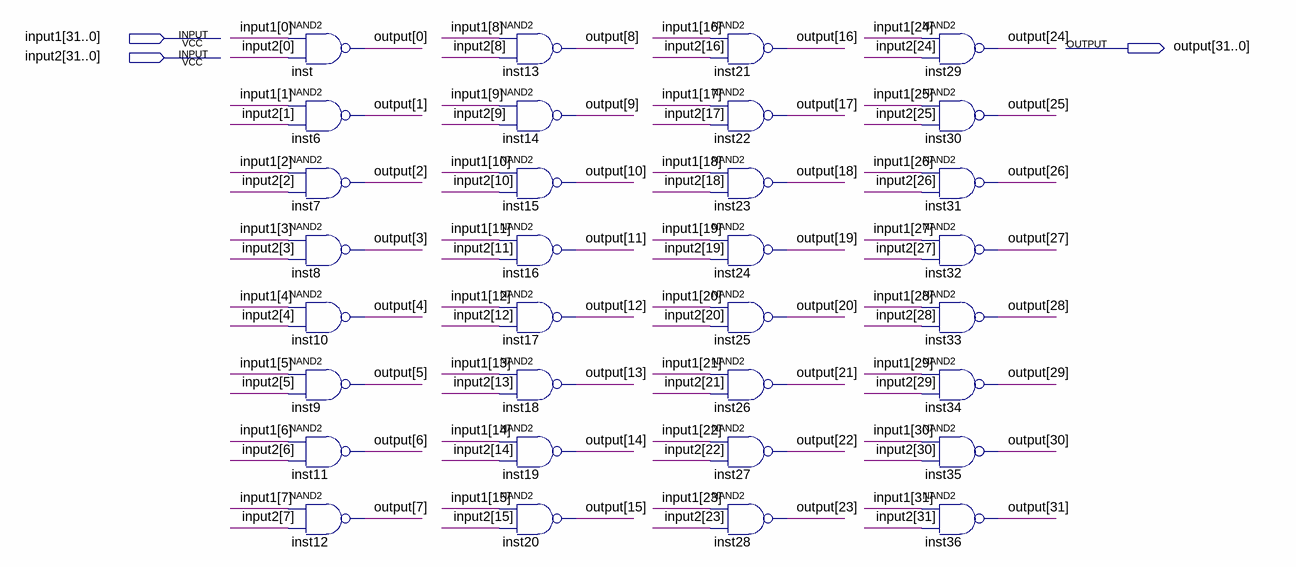
[diagram p0: schematic sheet]
// Quartus schematic Nand32.bdf as structural Verilog: 32 symbols, 3 pins
module Nand32 (
  input  [31:0] input1,
  input  [31:0] input2,
  output [31:0] \output 
);

  nand inst (\output [0], input1[0], input2[0]);
  nand inst6 (\output [1], input1[1], input2[1]);
  nand inst7 (\output [2], input1[2], input2[2]);
  nand inst8 (\output [3], input1[3], input2[3]);
  nand inst10 (\output [4], input1[4], input2[4]);
  nand inst9 (\output [5], input1[5], input2[5]);
  nand inst11 (\output [6], input1[6], input2[6]);
  nand inst12 (\output [7], input1[7], input2[7]);
  nand inst13 (\output [8], input1[8], input2[8]);
  nand inst14 (\output [9], input1[9], input2[9]);
  nand inst15 (\output [10], input1[10], input2[10]);
  nand inst16 (\output [11], input1[11], input2[11]);
  nand inst17 (\output [12], input1[12], input2[12]);
  nand inst18 (\output [13], input1[13], input2[13]);
  nand inst19 (\output [14], input1[14], input2[14]);
  nand inst20 (\output [15], input1[15], input2[15]);
  nand inst21 (\output [16], input1[16], input2[16]);
  nand inst22 (\output [17], input1[17], input2[17]);
  nand inst23 (\output [18], input1[18], input2[18]);
  nand inst24 (\output [19], input1[19], input2[19]);
  nand inst25 (\output [20], input1[20], input2[20]);
  nand inst26 (\output [21], input1[21], input2[21]);
  nand inst27 (\output [22], input1[22], input2[22]);
  nand inst28 (\output [23], input1[23], input2[23]);
  nand inst29 (\output [24], input1[24], input2[24]);
  nand inst30 (\output [25], input1[25], input2[25]);
  nand inst31 (\output [26], input1[26], input2[26]);
  nand inst32 (\output [27], input1[27], input2[27]);
  nand inst33 (\output [28], input1[28], input2[28]);
  nand inst34 (\output [29], input1[29], input2[29]);
  nand inst35 (\output [30], input1[30], input2[30]);
  nand inst36 (\output [31], input1[31], input2[31]);
endmodule
